# Altium project Pedal_MB.PrjPcb (part 2 of 4)

## Sheet MCU_AUDIO.SchDoc
size A1; SheetNumber: 7; SheetTotal: 13
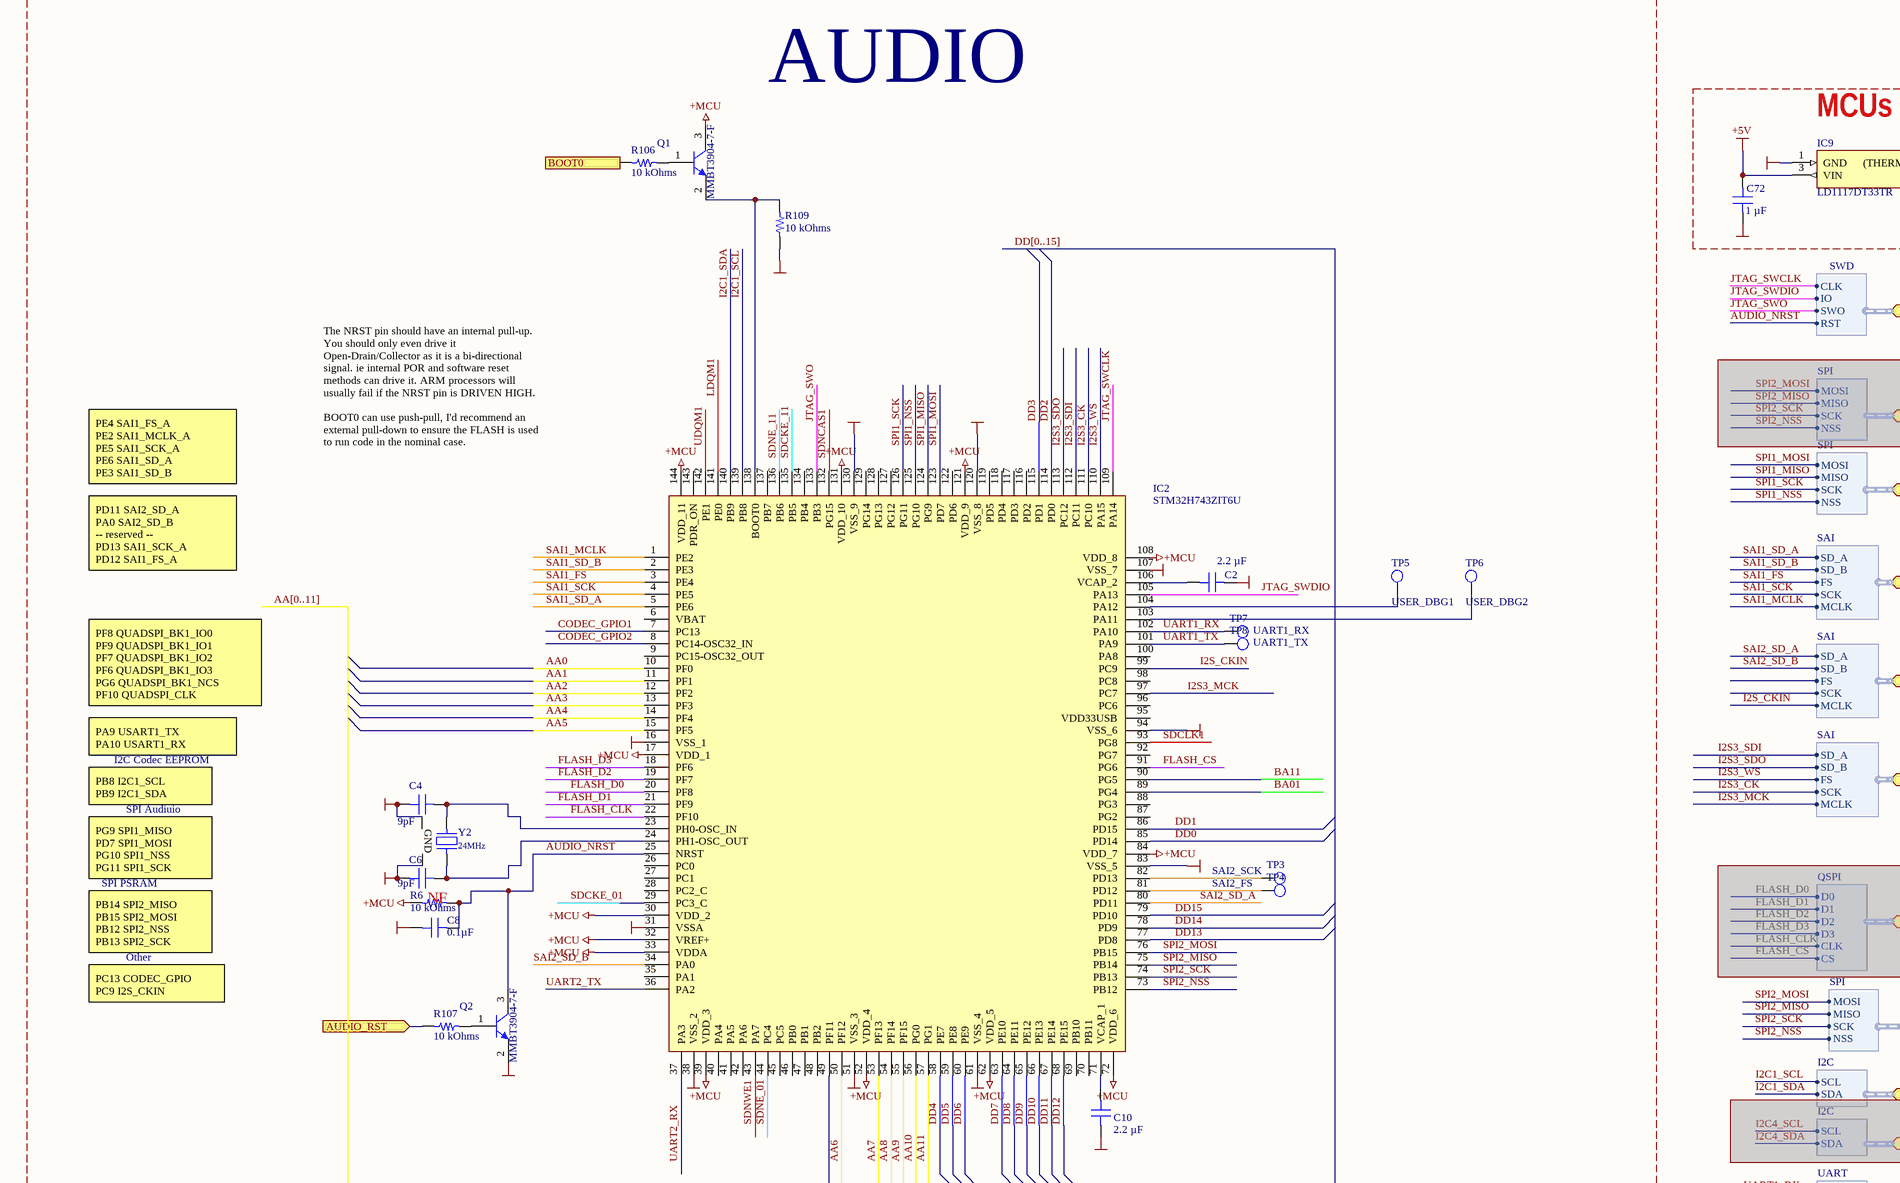
[diagram p9: MCU_AUDIO.SchDoc, top left]
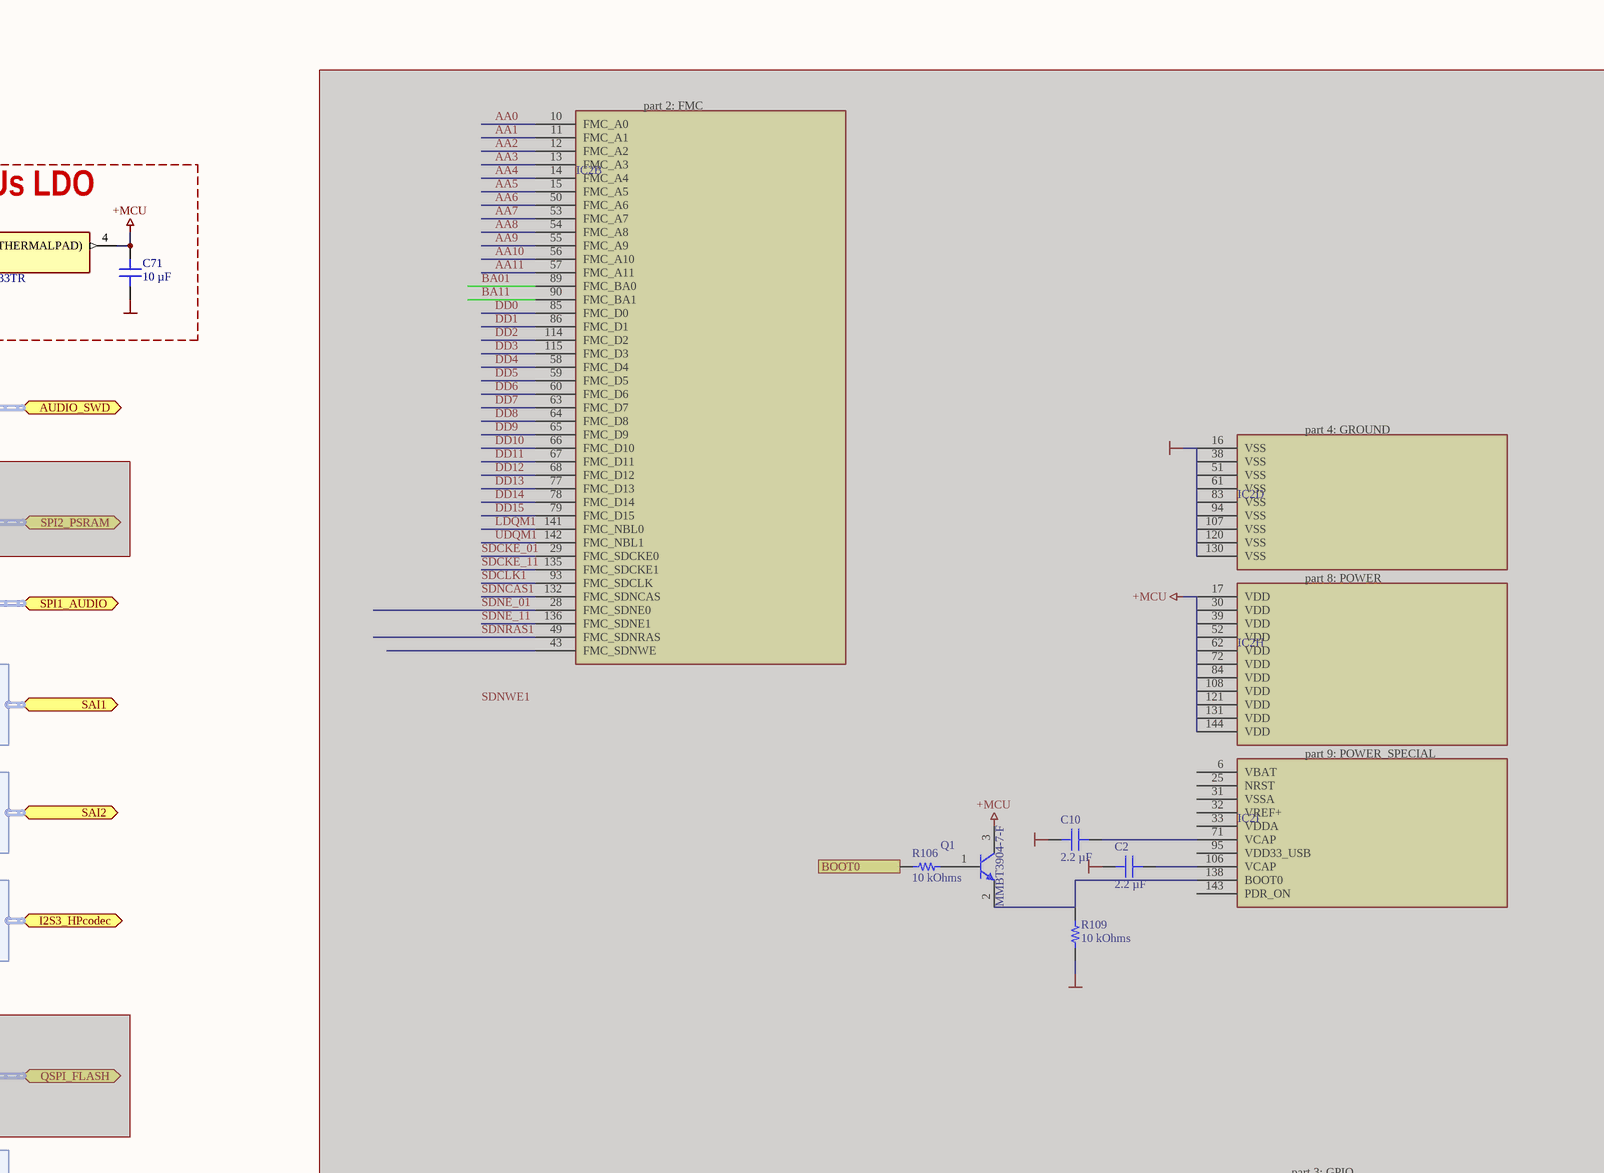
[diagram p10: MCU_AUDIO.SchDoc, top right]
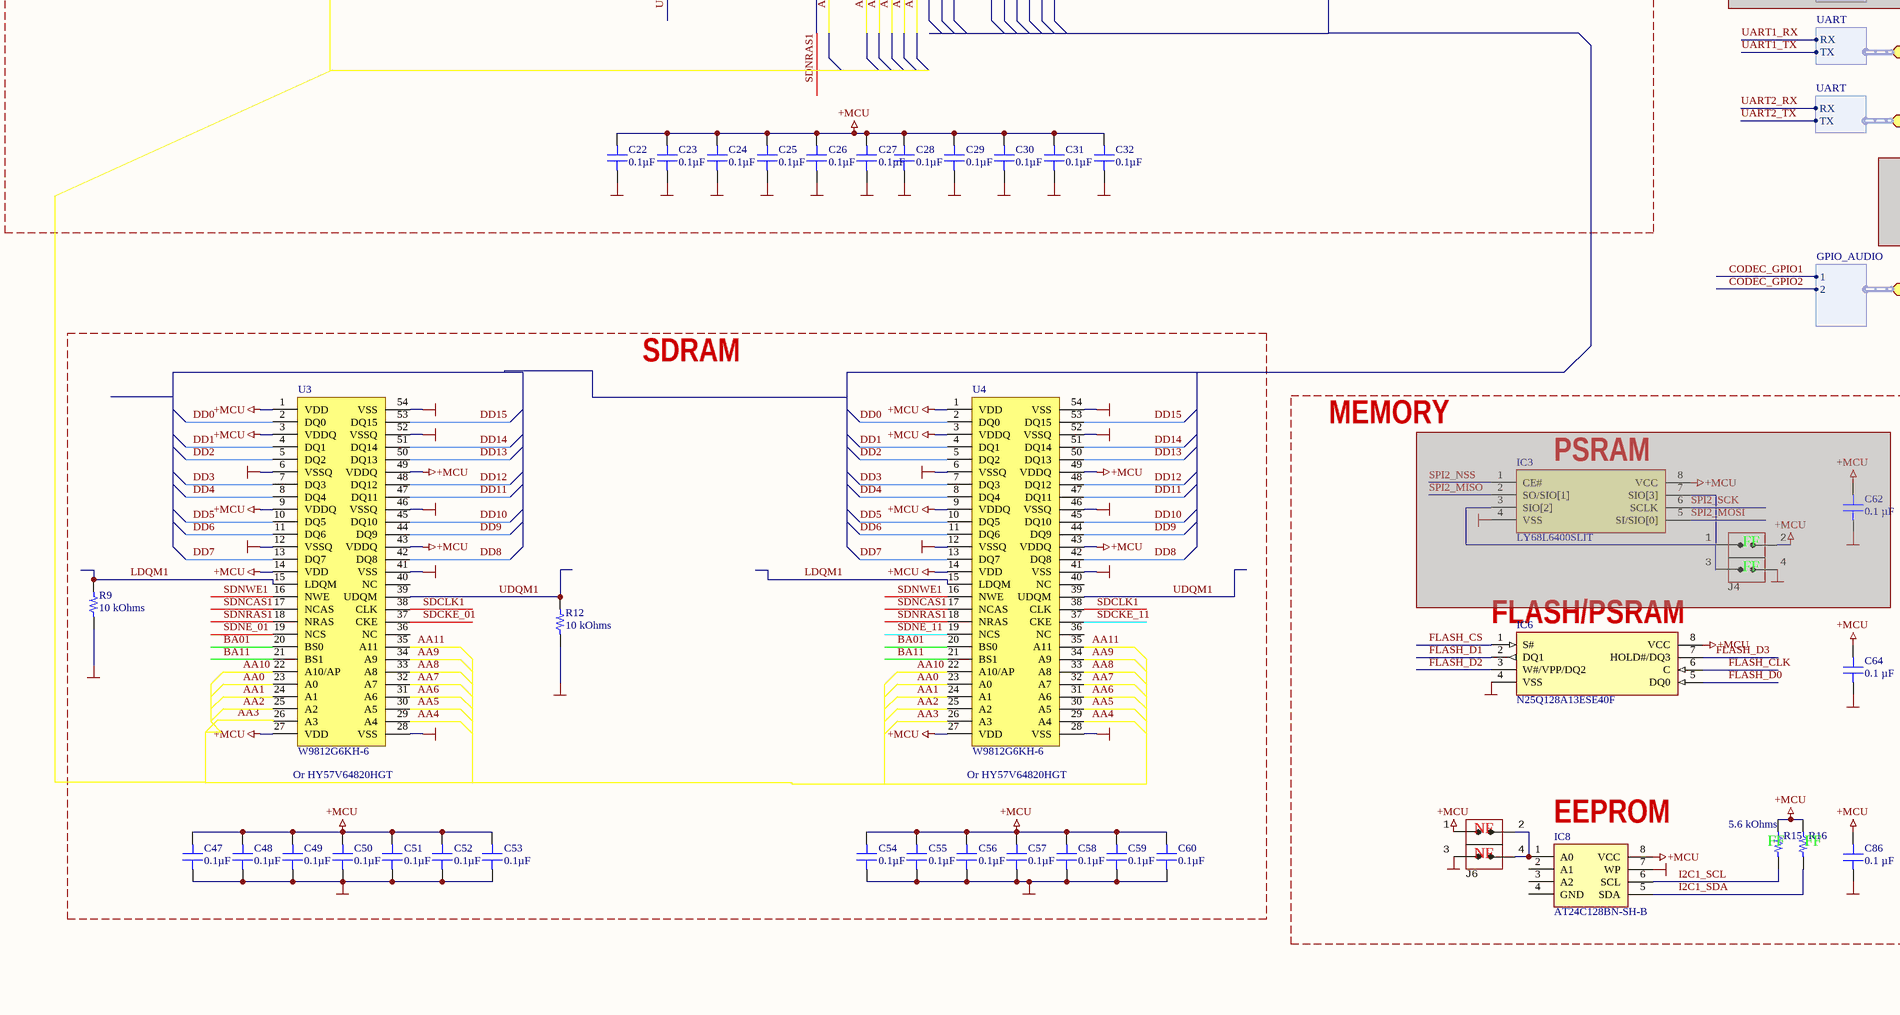
[diagram p11: MCU_AUDIO.SchDoc, bottom left]
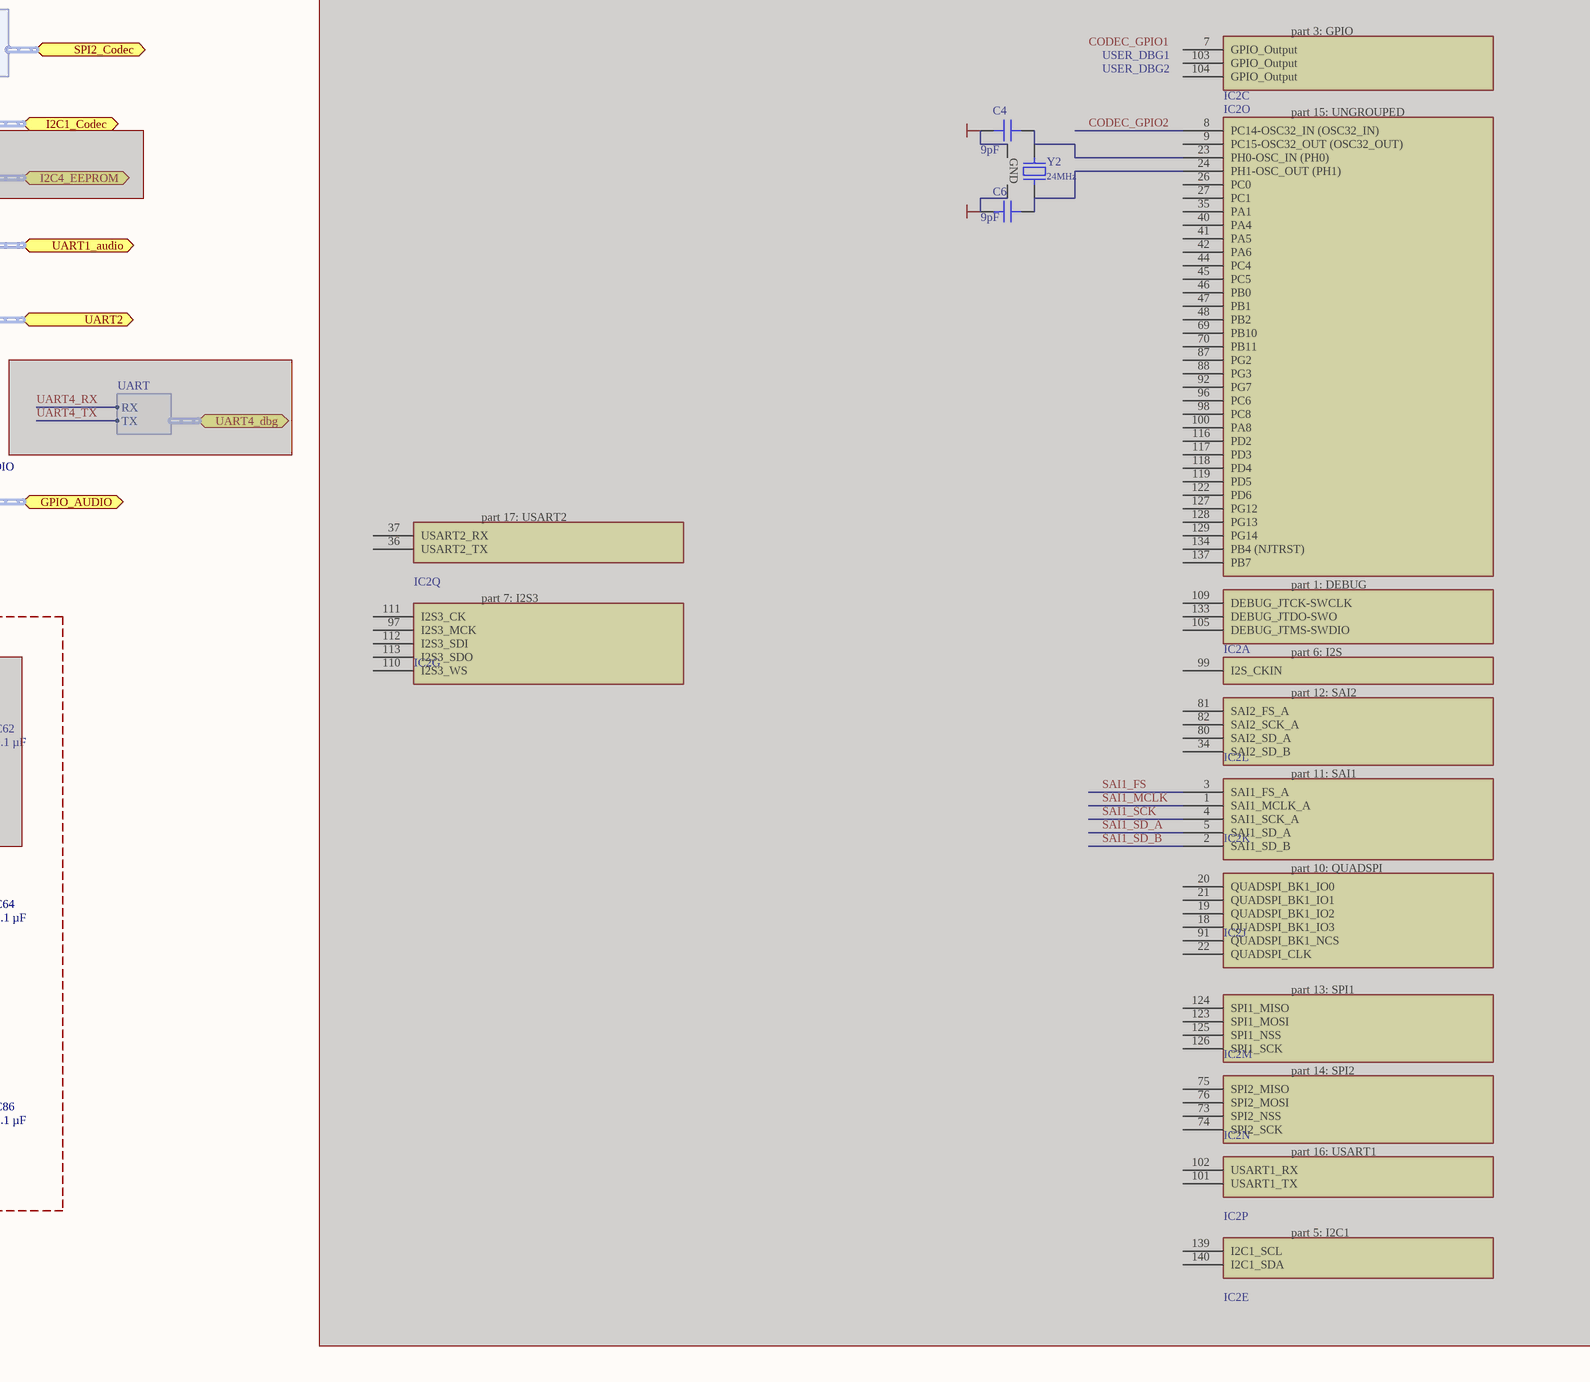
[diagram p12: MCU_AUDIO.SchDoc, bottom right]

### Parts
(Parts that share a designator on the sheet are numbered #1, #2 ... from top to bottom, then left to right.)
C2#1  2.2 µF  [CAP 0805_2012]
C2#2  2.2 µF  [CAP 0805_2012]  (masked out: inside a compile mask, not in the netlist)
C4#1  9pF  [CAP 0805_2012]
C4#2  9pF  [CAP 0805_2012]  (masked out: inside a compile mask, not in the netlist)
C6#1  9pF  [CAP 0805_2012]
C6#2  9pF  [CAP 0805_2012]  (masked out: inside a compile mask, not in the netlist)
C8  0.1µF  [CAP 0402_1005]
C10#1  2.2 µF  [CAP 0805_2012]  (masked out: inside a compile mask, not in the netlist)
C10#2  2.2 µF  [CAP 0805_2012]
C22  0.1µF  [CAP 0402_1005]
C23  0.1µF  [CAP 0402_1005]
C24  0.1µF  [CAP 0402_1005]
C25  0.1µF  [CAP 0402_1005]
C26  0.1µF  [CAP 0402_1005]
C27  0.1µF  [CAP 0402_1005]
C28  0.1µF  [CAP 0402_1005]
C29  0.1µF  [CAP 0402_1005]
C30  0.1µF  [CAP 0402_1005]
C31  0.1µF  [CAP 0402_1005]
C32  0.1µF  [CAP 0402_1005]
C47  0.1µF  [CAP 0402_1005]
C48  0.1µF  [CAP 0402_1005]
C49  0.1µF  [CAP 0402_1005]
C50  0.1µF  [CAP 0402_1005]
C51  0.1µF  [CAP 0402_1005]
C52  0.1µF  [CAP 0402_1005]
C53  0.1µF  [CAP 0402_1005]
C54  0.1µF  [CAP 0402_1005]
C55  0.1µF  [CAP 0402_1005]
C56  0.1µF  [CAP 0402_1005]
C57  0.1µF  [CAP 0402_1005]
C58  0.1µF  [CAP 0402_1005]
C59  0.1µF  [CAP 0402_1005]
C60  0.1µF  [CAP 0402_1005]
C62  0.1 µF  [CAP 0603_1608]  (masked out: inside a compile mask, not in the netlist)
C64  0.1 µF  [CAP 0603_1608]
C71  10 µF  [CAP 0805_2012]
C72  1 µF  [CAP 0805_2012]
C86  0.1 µF  [CAP 0603_1608]
IC2#1  STM32H743ZIT6U  [QFP50P2200X2200X160-144N]
IC2#2  MCU_pinout_audio  [QFP50P2200X2200X160-144N]  (value not drawn)  (parts A,B,C,D,E,F,G,H,I,J,K,L,M,N,O,P,Q of 17)  (masked out: inside a compile mask, not in the netlist)
IC3  LY68L6400SLIT  [SOIC127P600X175-8N]  (masked out: inside a compile mask, not in the netlist)
IC6  N25Q128A13ESE40F  [SOIC127P790X216-8N]
IC8  AT24C128BN-SH-B  [SOIC127P600X175-8N]
IC9  LD1117DT33TR  [TO228P972X240-3N]
J4#2  (no value)  [CON: JUMPER x2]  (masked out: inside a compile mask, not in the netlist)
J6#2  (no value)  [CON: JUMPER x2]
Q1#1  MMBT3904-7-F  [DIODES SOT-23-3]
Q1#2  MMBT3904-7-F  [DIODES SOT-23-3]  (masked out: inside a compile mask, not in the netlist)
Q2  MMBT3904-7-F  [DIODES SOT-23-3]
R6  10 kOhms  [RES 0603_1608]
R9  10 kOhms  [RES 0603_1608]
R12  10 kOhms  [RES 0603_1608]
R15  5.6 kOhms  [RES 0603_1608]
R16  5.6 kOhms  [RES 0603_1608]  (value not drawn)
R106#1  10 kOhms  [RES 0603_1608]
R106#2  10 kOhms  [RES 0603_1608]  (masked out: inside a compile mask, not in the netlist)
R107  10 kOhms  [RES 0603_1608]
R109#1  10 kOhms  [RES 0603_1608]
R109#2  10 kOhms  [RES 0603_1608]  (masked out: inside a compile mask, not in the netlist)
TP3  SAI2_SCK  [TESTPOINT]
TP4  SAI2_FS  [TESTPOINT]
TP5  USER_DBG1  [TESTPOINT]
TP6  USER_DBG2  [TESTPOINT]
TP7  UART1_RX  [TESTPOINT]
TP8  UART1_TX  [TESTPOINT]
U3  W9812G6KH-6  [TSOP-54]
U4  W9812G6KH-6  [TSOP-54]
Y2#1  24MHz  [NDK NX3225SA]
Y2#2  24MHz  [NDK NX3225SA]  (masked out: inside a compile mask, not in the netlist)

### Blocks framed on the sheet
AUDIO: C2#1 C4#1 C6#1 C8 C10#2 C22-C32 IC2#1 Q1#1 Q2 R6 R106#1 R107 R109#1 TP3-TP8 Y2#1
MCUs LDO: C71 C72 IC9
SDRAM: C47-C60 R9 R12 U3 U4

### Ports
AUDIO_RST (in), AUDIO_SWD (bidir, harness SWD), BOOT0 (in), GPIO_AUDIO (bidir, harness GPIO_AUDIO), I2C1_Codec (bidir, harness I2C), I2C4_EEPROM (bidir, harness I2C), I2S3_HPcodec (bidir, harness SAI), QSPI_FLASH (bidir, harness QSPI), SAI1 (bidir, harness SAI), SAI2 (bidir, harness SAI), SPI1_AUDIO (bidir, harness SPI), SPI2_Codec (bidir, harness SPI), SPI2_PSRAM (bidir, harness SPI), UART1_audio (bidir, harness UART), UART2 (bidir, harness UART), UART4_dbg (bidir, harness UART)

### Harnesses
SPI: MOSI, MISO, SCK, NSS
I2C: SCL, SDA
GPIO_AUDIO: 1, 2
UART: RX, TX
QSPI: D0, D1, D2, D3, CLK, CS
SAI: SD_A, SD_B, FS, SCK, MCLK
SWD: CLK, IO, SWO, RST

### Nets
+5V: C72.2 IC9.3(VIN)
+MCU: C22.1 C23.1 C24.1 C25.1 C26.1 C27.1 C28.1 C29.1 C30.1 C31.1 C32.1 C47.1 C48.1 C49.1 C50.1 C51.1 C52.1 C53.1 C54.1 C55.1 C56.1 C57.1 C58.1 C59.1 C60.1 C64.2 C71.2 C86.2 IC2#1.17(VDD_1) IC2#1.30(VDD_2) IC2#1.32(VREF+) IC2#1.33(VDDA) IC2#1.39(VDD_3) IC2#1.52(VDD_4) IC2#1.62(VDD_5) IC2#1.72(VDD_6) IC2#1.84(VDD_7) IC2#1.108(VDD_8) IC2#1.121(VDD_9) IC2#1.131(VDD_10) IC2#1.144(VDD_11) IC6.8(VCC) IC8.8(VCC) IC9.4((THERMALPAD)) J6#2.1(IN) Q1#1.3(C) R6.1 R15.2 R16.2 U3.1(VDD) U3.3(VDDQ) U3.9(VDDQ) U3.14(VDD) U3.27(VDD) U3.43(VDDQ) U3.49(VDDQ) U4.1(VDD) U4.3(VDDQ) U4.9(VDDQ) U4.14(VDD) U4.27(VDD) U4.43(VDDQ) U4.49(VDDQ)
GND: C2#1.2 C4#1.1 C6#1.1 C8.1 C10#2.1 C22.2 C23.2 C24.2 C25.2 C26.2 C27.2 C28.2 C29.2 C30.2 C31.2 C32.2 C47.2 C48.2 C49.2 C50.2 C51.2 C52.2 C53.2 C54.2 C55.2 C56.2 C57.2 C58.2 C59.2 C60.2 C64.1 C71.1 C72.1 C86.1 IC2#1.16(VSS_1) IC2#1.31(VSSA) IC2#1.38(VSS_2) IC2#1.51(VSS_3) IC2#1.61(VSS_4) IC2#1.83(VSS_5) IC2#1.94(VSS_6) IC2#1.107(VSS_7) IC2#1.120(VSS_8) IC2#1.130(VSS_9) IC6.4(VSS) IC8.7(WP) IC9.1(GND) J6#2.3(IN) Q2.2(E) R9.1 R12.1 R109#1.2 U3.6(VSSQ) U3.12(VSSQ) U3.28(VSS) U3.41(VSS) U3.46(VSSQ) U3.52(VSSQ) U3.54(VSS) U4.6(VSSQ) U4.12(VSSQ) U4.28(VSS) U4.41(VSS) U4.46(VSSQ) U4.52(VSSQ) U4.54(VSS) Y2#1.2(GND) Y2#1.4(GND)
AA0: IC2#1.10(PF0) U3.23(A0) U4.23(A0)  [project net AA0_7]
AA1: IC2#1.11(PF1) U3.24(A1) U4.24(A1)  [project net AA1_7]
AA2: IC2#1.12(PF2) U3.25(A2) U4.25(A2)  [project net AA2_7]
AA3: IC2#1.13(PF3) U3.26(A3) U4.26(A3)  [project net AA3_7]
AA4: IC2#1.14(PF4) U3.29(A4) U4.29(A4)  [project net AA4_7]
AA5: IC2#1.15(PF5) U3.30(A5) U4.30(A5)  [project net AA5_7]
AA6: IC2#1.50(PF12) U3.31(A6) U4.31(A6)  [project net AA6_7]
AA7: IC2#1.53(PF13) U3.32(A7) U4.32(A7)  [project net AA7_7]
AA8: IC2#1.54(PF14) U3.33(A8) U4.33(A8)  [project net AA8_7]
AA9: IC2#1.55(PF15) U3.34(A9) U4.34(A9)  [project net AA9_7]
AA10: IC2#1.56(PG0) U3.22(A10/AP) U4.22(A10/AP)  [project net AA10_7]
AA11: IC2#1.57(PG1) U3.35(A11) U4.35(A11)  [project net AA11_7]
AUDIO_BOOT: R106#1.1 ; port BOOT0
AUDIO_NRST: C8.2 IC2#1.25(NRST) Q2.3(C) R6.2 ; port AUDIO_SWD.RST
AUDIO_RST: R107.1 ; port AUDIO_RST
BA01: IC2#1.89(PG4) U3.20(BS0) U4.20(BS0)  [project net BA01_7]
BA11: IC2#1.90(PG5) U3.21(BS1) U4.21(BS1)  [project net BA11_7]
CODEC_GPIO1: IC2#1.7(PC13) ; port GPIO_AUDIO.1
CODEC_GPIO2: IC2#1.8(PC14-OSC32_IN) ; port GPIO_AUDIO.2
DD0: IC2#1.85(PD14) U3.2(DQ0) U4.2(DQ0)  [project net DD0_7]
DD1: IC2#1.86(PD15) U3.4(DQ1) U4.4(DQ1)  [project net DD1_7]
DD2: IC2#1.114(PD0) U3.5(DQ2) U4.5(DQ2)  [project net DD2_7]
DD3: IC2#1.115(PD1) U3.7(DQ3) U4.7(DQ3)  [project net DD3_7]
DD4: IC2#1.58(PE7) U3.8(DQ4) U4.8(DQ4)  [project net DD4_7]
DD5: IC2#1.59(PE8) U3.10(DQ5) U4.10(DQ5)  [project net DD5_7]
DD6: IC2#1.60(PE9) U3.11(DQ6) U4.11(DQ6)  [project net DD6_7]
DD7: IC2#1.63(PE10) U3.13(DQ7) U4.13(DQ7)  [project net DD7_7]
DD8: IC2#1.64(PE11) U3.42(DQ8) U4.42(DQ8)  [project net DD8_7]
DD9: IC2#1.65(PE12) U3.44(DQ9) U4.44(DQ9)  [project net DD9_7]
DD10: IC2#1.66(PE13) U3.45(DQ10) U4.45(DQ10)  [project net DD10_7]
DD11: IC2#1.67(PE14) U3.47(DQ11) U4.47(DQ11)  [project net DD11_7]
DD12: IC2#1.68(PE15) U3.48(DQ12) U4.48(DQ12)  [project net DD12_7]
DD13: IC2#1.77(PD8) U3.50(DQ13) U4.50(DQ13)  [project net DD13_7]
DD14: IC2#1.78(PD9) U3.51(DQ14) U4.51(DQ14)  [project net DD14_7]
DD15: IC2#1.79(PD10) U3.53(DQ15) U4.53(DQ15)  [project net DD15_7]
FLASH_CLK: IC2#1.22(PF10) IC6.6(C)  [project net FLASH_CLK_7]
FLASH_CS: IC2#1.91(PG6) IC6.1(S#)  [project net FLASH_CS_7]
FLASH_D0: IC2#1.20(PF8) IC6.5(DQ0)  [project net FLASH_D0_7]
FLASH_D1: IC2#1.21(PF9) IC6.2(DQ1)  [project net FLASH_D1_7]
FLASH_D2: IC2#1.19(PF7) IC6.3(W#/VPP/DQ2)  [project net FLASH_D2_7]
FLASH_D3: IC2#1.18(PF6) IC6.7(HOLD#/DQ3)  [project net FLASH_D3_7]
I2C1_SCL: IC2#1.139(PB8) IC8.6(SCL) R15.1 ; port I2C1_Codec.SCL
I2C1_SDA: IC2#1.140(PB9) IC8.5(SDA) R16.1 ; port I2C1_Codec.SDA
I2S3_CK: IC2#1.111(PC10) ; port I2S3_HPcodec.SCK
I2S3_MCK: IC2#1.97(PC7) ; port I2S3_HPcodec.MCLK
I2S3_SDI: IC2#1.112(PC11) ; port I2S3_HPcodec.SD_A
I2S3_SDO: IC2#1.113(PC12) ; port I2S3_HPcodec.SD_B
I2S3_WS: IC2#1.110(PA15) ; port I2S3_HPcodec.FS
I2S_CKIN: IC2#1.99(PC9) ; port SAI2.MCLK
JTAG_SWCLK: IC2#1.109(PA14) ; port AUDIO_SWD.CLK  [project net AUDIO_SWD.CLK]
JTAG_SWDIO: IC2#1.105(PA13) ; port AUDIO_SWD.IO  [project net AUDIO_SWD.IO]
JTAG_SWO: IC2#1.133(PB3) ; port AUDIO_SWD.SWO  [project net AUDIO_SWD.SWO]
LDQM1: IC2#1.141(PE0) R9.2 U3.15(LDQM) U4.15(LDQM)  [project net LDQM1_7]
SAI1_FS: IC2#1.3(PE4) ; port SAI1.FS
SAI1_MCLK: IC2#1.1(PE2) ; port SAI1.MCLK
SAI1_SCK: IC2#1.4(PE5) ; port SAI1.SCK
SAI1_SD_A: IC2#1.5(PE6) ; port SAI1.SD_A
SAI1_SD_B: IC2#1.2(PE3) ; port SAI1.SD_B
SAI2_SD_A: IC2#1.80(PD11) ; port SAI2.SD_A
SAI2_SD_B: IC2#1.34(PA0) ; port SAI2.SD_B
SDCKE_01: IC2#1.29(PC3_C) U3.37(CKE)  [project net SDCKE_01_7]
SDCKE_11: IC2#1.135(PB5) U4.37(CKE)  [project net SDCKE_11_7]
SDCLK1: IC2#1.93(PG8) U3.38(CLK) U4.38(CLK)  [project net SDCLK1_7]
SDNCAS1: IC2#1.132(PG15) U3.17(NCAS) U4.17(NCAS)  [project net SDNCAS1_7]
SDNE_01: IC2#1.44(PC4) U3.19(NCS)  [project net SDNE_01_7]
SDNE_11: IC2#1.136(PB6) U4.19(NCS)  [project net SDNE_11_7]
SDNRAS1: IC2#1.49(PF11) U3.18(NRAS) U4.18(NRAS)  [project net SDNRAS1_7]
SDNWE1: IC2#1.43(PA7) U3.16(NWE) U4.16(NWE)  [project net SDNWE1_7]
SPI1_MISO: IC2#1.124(PG9) ; port SPI1_AUDIO.MISO
SPI1_MOSI: IC2#1.123(PD7) ; port SPI1_AUDIO.MOSI
SPI1_NSS: IC2#1.125(PG10) ; port SPI1_AUDIO.NSS
SPI1_SCK: IC2#1.126(PG11) ; port SPI1_AUDIO.SCK
SPI2_MISO: IC2#1.75(PB14) ; port SPI2_Codec.MISO
SPI2_MOSI: IC2#1.76(PB15) ; port SPI2_Codec.MOSI
SPI2_NSS: IC2#1.73(PB12) ; port SPI2_Codec.NSS
SPI2_SCK: IC2#1.74(PB13) ; port SPI2_Codec.SCK
UART1_RX: IC2#1.102(PA10) TP7.1 ; port UART1_audio.RX
UART1_TX: IC2#1.101(PA9) TP8.1 ; port UART1_audio.TX
UART2_RX: IC2#1.37(PA3) ; port UART2.RX
UART2_TX: IC2#1.36(PA2) ; port UART2.TX
UDQM1: IC2#1.142(PE1) R12.2 U3.39(UDQM) U4.39(UDQM)  [project net UDQM1_7]
NetC2#1_1: C2#1.1 IC2#1.106(VCAP_2)
NetC4#1_2: C4#1.2 IC2#1.23(PH0-OSC_IN) Y2#1.1
NetC6#1_2: C6#1.2 IC2#1.24(PH1-OSC_OUT) Y2#1.3
NetC10#2_2: C10#2.2 IC2#1.71(VCAP_1)
NetIC2#1_81: IC2#1.81(PD12) TP4.1
NetIC2#1_82: IC2#1.82(PD13) TP3.1
NetIC2#1_103: IC2#1.103(PA11) TP6.1
NetIC2#1_104: IC2#1.104(PA12) TP5.1
NetIC2#1_138: IC2#1.138(BOOT0) Q1#1.2(E) R109#1.1
NetIC8_1: IC8.1(A0) J6#2.2(IN) J6#2.4(IN)
NetQ1#1_1: Q1#1.1(B) R106#1.2
NetQ2_1: Q2.1(B) R107.2

Not connected (* = marked no-connect by the designer): IC2#1 6(VBAT) 9(PC15-OSC32_OUT) 26(PC0) 27(PC1) 28(PC2_C) 35(PA1) 40(PA4) 41(PA5) 42(PA6) 45(PC5) 46(PB0) 47(PB1) 48(PB2) 69(PB10) 70(PB11) 87(PG2) 88(PG3) 92(PG7) 95(VDD33USB) 96(PC6) 98(PC8) 100(PA8) 116(PD2) 117(PD3) 118(PD4) 119(PD5) 122(PD6) 127(PG12) 128(PG13) 129(PG14) 134(PB4) 137(PB7) 143(PDR_ON); IC8 2(A1) 3(A2) 4(GND); U3 36(NC) 40(NC); U4 36(NC) 40(NC)

### Buses and harness runs
bus AA[0..11]
bus DD[0..15]

### Notes on the sheet
- PE4	SAI1_FS_A
  PE2	SAI1_MCLK_A
  PE5	SAI1_SCK_A
  PE6	SAI1_SD_A
  PE3	SAI1_SD_B
- The NRST pin should have an internal pull-up. You should only even drive it Open-Drain/Collector as it is a bi-directional signal. ie internal POR and software reset methods can drive it. ARM processors will usually fail if the NRST pin is DRIVEN HIGH.
  BOOT0 can use push-pull, I'd recommend an external pull-down to ensure the FLASH is used to run code in the nominal case.
- PD11	SAI2_SD_A
  PA0	SAI2_SD_B
  -- reserved --
  PD13	SAI1_SCK_A
  PD12	SAI1_FS_A
- PF8	QUADSPI_BK1_IO0
  PF9	QUADSPI_BK1_IO1
  PF7	QUADSPI_BK1_IO2
  PF6	QUADSPI_BK1_IO3
  PG6	QUADSPI_BK1_NCS
  PF10	QUADSPI_CLK
- PA9	USART1_TX
  PA10	USART1_RX
- I2C Codec EEPROM
- PB8	I2C1_SCL
  PB9	I2C1_SDA
- SPI Audiuio
- PG9	SPI1_MISO
  PD7	SPI1_MOSI
  PG10	SPI1_NSS
  PG11	SPI1_SCK
- SPI PSRAM
- (near R6) NF
- PB14	SPI2_MISO
  PB15	SPI2_MOSI
  PB12	SPI2_NSS
  PB13	SPI2_SCK
- Other
- PC13	CODEC_GPIO
  PC9	I2S_CKIN
- USER_DBG1
- USER_DBG2
- MEMORY
- (near IC3) PSRAM
- (near J4#2) FF
- (near IC6) FLASH/PSRAM
- (near U3) Or HY57V64820HGT
- (near U4) Or HY57V64820HGT
- (near J6#2) NF
- (near IC8) EEPROM
- (near R15) FF
- (near R16) FF
- (in symbol MCU_pinout_audio, part A) part 1: DEBUG
- (in symbol MCU_pinout_audio, part B) part 2: FMC
- (in symbol MCU_pinout_audio, part C) part 3: GPIO
- (in symbol MCU_pinout_audio, part D) part 4: GROUND
- (in symbol MCU_pinout_audio, part E) part 5: I2C1
- (in symbol MCU_pinout_audio, part F) part 6: I2S
- (in symbol MCU_pinout_audio, part G) part 7: I2S3
- (in symbol MCU_pinout_audio, part H) part 8: POWER
- (in symbol MCU_pinout_audio, part I) part 9: POWER_SPECIAL
- (in symbol MCU_pinout_audio, part J) part 10: QUADSPI
- (in symbol MCU_pinout_audio, part K) part 11: SAI1
- (in symbol MCU_pinout_audio, part L) part 12: SAI2
- (in symbol MCU_pinout_audio, part M) part 13: SPI1
- (in symbol MCU_pinout_audio, part N) part 14: SPI2
- (in symbol MCU_pinout_audio, part O) part 15: UNGROUPED
- (in symbol MCU_pinout_audio, part P) part 16: USART1
- (in symbol MCU_pinout_audio, part Q) part 17: USART2

### Library data of the parts
C2#1 C2#2 C10#1 C10#2 = C0805C225K8RAC7800: CAP CER 2.2UF 10V X7R 0805; manufacturer: KEMET; Tolerance: ±10%; Part Number: C0805C225K8RAC7800; Value: 2.2 µF; Applications: Bypass, Decoupling; Capacitance: 2.2 µF; componentlink1description: Datasheet; componentlink1url: https://api.kemet.com/component-edge/download/datasheet/C0805C225K8RACTU.pdf; componentlink2description: DigiKey Link; componentlink2url: https://www.digikey.com/en/products/detail/kemet/C0805C225K8RAC7800/789654; Device Package: 0805 (2012 Metric); lastupdated: 3/27/2023 7:09:32 PM; Lifecycle Status: Active; Minimum Order: 1; Mounting Type: Surface Mount, MLCC; Operating Temperature: -55°C ~ 125°C; Package / Case: 0805 (2012 Metric); packaging: TapeAndReel; partid: 32363; Part Status: Active; price: 0.03; series: SMD Comm X7R; Size / Dimension: 0.079" L x 0.049" W (2.00mm x 1.25mm); Supplier 1: DigiKey; Supplier Part Number 1: 399-C0805C225K8RAC7800CT-ND; Temperature Coefficient: X7R; Thickness (Max): 0.055" (1.40mm); Voltage - Rated: 10V
C4#1 C4#2 C6#1 C6#2 = CBR08C909CAGAC: CAP CER 9PF 250V C0G/NP0 0805; Manufacturer: KEMET; Temperature Coefficient: C0G, NP0; Tolerance: ±0.25pF; Part Number: CBR08C909CAGAC; Value: 9pF; Applications: RF, Microwave, High Frequency; Capacitance: 9pF; ComponentLink1Description: Datasheet; ComponentLink1URL: https://api.kemet.com/component-edge/download/datasheet/CBR08C909CAGAC.pdf; ComponentLink2Description: DigiKey Link; ComponentLink2URL: http://digikey.com/product-detail/en/kemet/CBR08C909CAGAC/399-8711-1-ND/3480335; Device Package: 0805 (2012 Metric); Features: High Q, Low Loss, Ultra Low ESR; LastUpdated: 9/2/2020 1:04:31 AM; Lifecycle Status: Active; Minimum Order: 1; Mounting Type: Surface Mount, MLCC; Operating Temperature: -55°C ~ 125°C; Package / Case: 0805 (2012 Metric); Packaging: TapeAndReel; PartId: 8592; Part Status: Active; Price: 0.28; Series: CBR-SMD RF C0G; Size / Dimension: 0.079" L x 0.049" W (2.00mm x 1.25mm); Supplier 1: DigiKey; Supplier Part Number 1: 399-8711-1-ND; Thickness (Max): 0.035" (0.88mm); Voltage - Rated: 250V
C8 C22-C32 C47-C60 = C0402C104K4RACAUTO: CAP CER 0.1UF 16V X7R 0402; Manufacturer: KEMET; Tolerance: ±10%; Part Number: C0402C104K4RACAUTO; Value: 0.1µF; Applications: Automotive, Bypass, Decoupling; Capacitance: 0.1µF; ComponentLink1Description: Datasheet; ComponentLink1URL: https://api.kemet.com/component-edge/download/specsheet/C0402C104K4RACAUTO.pdf; ComponentLink2Description: DigiKey Link; ComponentLink2URL: http://digikey.com/product-detail/en/kemet/C0402C104K4RACAUTO/399-6828-1-ND/3314343; Device Package: 0402 (1005 Metric); LastUpdated: 9/2/2020 1:02:21 AM; Lifecycle Status: Active; Minimum Order: 1; Mounting Type: Surface Mount, MLCC; Operating Temperature: -55°C ~ 125°C; Package / Case: 0402 (1005 Metric); Packaging: TapeAndReel; PartId: 3024; Part Status: Active; Price: 0.01; Ratings: AEC-Q200; Series: SMD Auto X7R; Size / Dimension: 0.039" L x 0.020" W (1.00mm x 0.50mm); Supplier 1: DigiKey; Supplier Part Number 1: 399-6828-1-ND; Temperature Coefficient: X7R; Thickness (Max): 0.022" (0.55mm); Voltage - Rated: 16V
C62 C64 C86 = C0603C104K5RAC7411: CAP CER 0.1UF 50V X7R 0603; manufacturer: KEMET; Tolerance: ±10%; Part Number: C0603C104K5RAC7411; Value: 0.1 µF; Applications: Bypass, Decoupling; Capacitance: 0.1 µF; componentlink1description: Datasheet; componentlink1url: https://api.kemet.com/component-edge/download/datasheet/C0603C104K5RAC7411.pdf; componentlink2description: DigiKey Link; componentlink2url: https://www.digikey.com/en/products/detail/kemet/C0603C104K5RAC7411/3317013; Device Package: 0603 (1608 Metric); lastupdated: 2/9/2024 8:10:30 PM; Lifecycle Status: Active; Minimum Order: 1; Mounting Type: Surface Mount, MLCC; Operating Temperature: -55°C ~ 125°C; Package / Case: 0603 (1608 Metric); packaging: TapeAndReel; partid: 2233; Part Status: Active; price: 0.01; series: SMD Comm X7R; Size / Dimension: 0.063" L x 0.031" W (1.60mm x 0.80mm); Supplier 1: DigiKey; Supplier Part Number 1: 399-C0603C104K5RAC7411CT-ND; Temperature Coefficient: X7R; Thickness (Max): 0.035" (0.90mm); Voltage - Rated: 50V
C71 = C0805C106K8PAC7800: CAP CER 10UF 10V X5R 0805; manufacturer: KEMET; Tolerance: ±10%; Part Number: C0805C106K8PAC7800; Value: 10 µF; Applications: Bypass, Decoupling; Capacitance: 10 µF; componentlink1description: Datasheet; componentlink1url: https://connect.kemet.com:7667/gateway/IntelliData-ComponentDocumentation/1.0/download/datasheet/C0805C106K8PACTU; componentlink2description: DigiKey Link; componentlink2url: https://www.digikey.com/en/products/detail/kemet/C0805C106K8PAC7800/1090830; Device Package: 0805 (2012 Metric); lastupdated: 9/14/2022 7:51:56 AM; Lifecycle Status: Active; Minimum Order: 1; Mounting Type: Surface Mount, MLCC; Operating Temperature: -55°C ~ 85°C; Package / Case: 0805 (2012 Metric); packaging: TapeAndReel; partid: 44790; Part Status: Active; price: 0.02; series: SMD Comm X5R; Size / Dimension: 0.079" L x 0.049" W (2.00mm x 1.25mm); Supplier 1: DigiKey; Supplier Part Number 1: 399-C0805C106K8PAC7800CT-ND; Temperature Coefficient: X5R; Thickness (Max): 0.055" (1.40mm); Voltage - Rated: 10V
C72 = C0805C105K4RAC7800: CAP CER 1UF 16V X7R 0805; manufacturer: KEMET; Tolerance: ±10%; Part Number: C0805C105K4RAC7800; Value: 1 µF; Applications: Bypass, Decoupling; Capacitance: 1 µF; componentlink1description: Datasheet; componentlink1url: https://api.kemet.com/component-edge/download/datasheet/C0805C105K4RACTU.pdf; componentlink2description: DigiKey Link; componentlink2url: https://www.digikey.com/en/products/detail/kemet/C0805C105K4RAC7800/416047; Device Package: 0805 (2012 Metric); lastupdated: 9/19/2022 1:03:30 PM; Lifecycle Status: Active; Minimum Order: 1; Mounting Type: Surface Mount, MLCC; Operating Temperature: -55°C ~ 125°C; Package / Case: 0805 (2012 Metric); packaging: TapeAndReel; partid: 32075; Part Status: Active; price: 0.01; series: SMD Comm X7R; Size / Dimension: 0.079" L x 0.049" W (2.00mm x 1.25mm); Supplier 1: DigiKey; Supplier Part Number 1: 399-C0805C105K4RAC7800CT-ND; Temperature Coefficient: X7R; Thickness (Max): 0.039" (1.00mm); Voltage - Rated: 16V
IC2#1 = STM32H743ZIT6U: Integrated Circuit; Manufacturer_Name: STMicroelectronics; Datasheet Link: https://componentsearchengine.com/Datasheets/1/STM32H743ZIT6U.pdf; Height: 1.6mm; Manufacturer_Part_Number: STM32H743ZIT6U; Mouser Part Number: N/A; Mouser Price/Stock: https://www.mouser.co.uk/ProductDetail/STMicroelectronics/STM32H743ZIT6U?qs=PzGy0jfpSMtTUBlZwwPqMQ%3D%3D
IC2#2 = MCU_pinout_audio: MCU with 144 pins / Grouped by function
IC3 = LY68L6400SLIT: Integrated Circuit; Manufacturer_Name: Lyontek Inc.; Datasheet Link: https://datasheet.lcsc.com/szlcsc/Lyontek-Inc-LY68L6400SLIT_C261881.pdf; Height: 1.75mm; Manufacturer_Part_Number: LY68L6400SLIT
IC6 = N25Q128A13ESE40F: Integrated Circuit; Manufacturer_Name: Micron; Datasheet Link: https://datasheet.datasheetarchive.com/originals/distributors/Datasheets-DGA23/1494983.pdf; Height: 2.16mm; Manufacturer_Part_Number: N25Q128A13ESE40F; Mouser Part Number: 340-182267; Mouser Price/Stock: https://www.mouser.co.uk/ProductDetail/Micron/N25Q128A13ESE40F?qs=taEdVNyAfdHw8xv9Y4zfpQ%3D%3D; Arrow Part Number: N25Q128A13ESE40F; Arrow Price/Stock: https://www.arrow.com/en/products/n25q128a13ese40f/micron-technology
IC8 = AT24C128BN-SH-B: Integrated Circuit; Manufacturer_Name: Microchip; Datasheet Link: https://componentsearchengine.com/Datasheets/1/AT24C128BN-SH-B.pdf; Height: 1.75mm; Manufacturer_Part_Number: AT24C128BN-SH-B; Mouser Part Number: 556-A24C128BNSH-B; Mouser Price/Stock: https://www.mouser.co.uk/ProductDetail/Microchip-Technology-Atmel/AT24C128BN-SH-B?qs=j6lVIf5KywAfpl9r4qbAuQ%3D%3D
IC9 = LD1117DT33TR: Integrated Circuit; Manufacturer_Name: STMicroelectronics; Datasheet Link: http://www.st.com/web/en/resource/technical/document/datasheet/CD00000544.pdf; Height: 2.4mm; Manufacturer_Part_Number: LD1117DT33TR; Mouser Part Number: 511-LD1117DT33-TR; Mouser Price/Stock: https://www.mouser.co.uk/ProductDetail/STMicroelectronics/LD1117DT33TR?qs=4JhUBQGAOSd4P5jVYGxp2g%3D%3D; Arrow Part Number: LD1117DT33TR; Arrow Price/Stock: https://www.arrow.com/en/products/ld1117dt33tr/stmicroelectronics?region=nac
J4#2 J6#2 = Jumper_double: CommentText: "Перемычка"
Q1#1 Q1#2 Q2 = MMBT3904-7-F: TRANS NPN 40V 0.2A SOT23-3; Manufacturer: Diodes Incorporated; Current - Collector Cutoff (Max): 50nA (ICBO); Current - Collector (Ic) (Max): 200 mA; DC Current Gain (hFE) (Min) @ Ic, Vce: 100 @ 10mA, 1V; Frequency - Transition: 300MHz; Power - Max: 300 mW; Vce Saturation (Max) @ Ib, Ic: 300mV @ 5mA, 50mA; Part Number: MMBT3904-7-F; ComponentLink1Description: Datasheet; ComponentLink1URL: https://www.diodes.com/assets/Datasheets/ds30036.pdf; ComponentLink2Description: DigiKey Link; ComponentLink2URL: https://www.digikey.com/en/products/detail/diodes-incorporated/MMBT3904-7-F/814494; LastUpdated: 2/8/2024 9:54:04 PM; Lifecycle Status: Active; Minimum Order: 1; Mounting Type: Surface Mount; Operating Temperature: -55°C ~ 150°C (TJ); Package / Case: TO-236-3, SC-59, SOT-23-3; Packaging: TapeAndReel; PartId: 85; Part Status: Active; Price: 0.01; Series: -; Supplier 1: DigiKey; Supplier Part Number 1: MMBT3904-FDICT-ND; Supplier Device Package: SOT-23-3; Transistor Type: NPN; Voltage - Collector Emitter Breakdown (Max): 40 V
R6 R9 R12 R106#1 R106#2 R107 R109#1 R109#2 = ERJ-3EKF1002V: RES SMD 10K OHM 1% 1/10W 0603; Manufacturer: Panasonic Electronic Components; Power (Watts): 0.1W, 1/10W; Temperature Coefficient: ±100ppm/°C; Part Number: ERJ-3EKF1002V; Value: 10 kOhms; ComponentLink1Description: Datasheet; ComponentLink1URL: https://industrial.panasonic.com/cdbs/www-data/pdf/RDA0000/AOA0000C304.pdf; ComponentLink2Description: DigiKey Link; ComponentLink2URL: https://www.digikey.com/en/products/detail/panasonic-electronic-components/ERJ-3EKF1002V/196066; Composition: Thick Film; Device Package: 0603 (1608 Metric); Height - Seated (Max): 0.022" (0.55mm); LastUpdated: 2/9/2024 8:41:59 PM; Lifecycle Status: Active; Minimum Order: 1; Number of Terminations: 2; Operating Temperature: -55°C ~ 155°C; Package / Case: 0603 (1608 Metric); Packaging: TapeAndReel; PartId: 25695; Part Status: Active; Price: 0.01; Resistance: 10 kOhms; Series: ERJ-3EK; Size / Dimension: 0.063" L x 0.031" W (1.60mm x 0.80mm); Supplier 1: DigiKey; Supplier Part Number 1: P10.0KHCT-ND; Supplier Device Package: 0603; Tolerance: ±1%; Features: Automotive AEC-Q200; Ratings: AEC-Q200
R15 R16 = RT0603DRE075K6L: RES SMD 5.6K OHM 0.5% 1/10W 0603; Manufacturer: Yageo; Power (Watts): 0.1W, 1/10W; Temperature Coefficient: ±50ppm/°C; Part Number: RT0603DRE075K6L; Value: 5.6 kOhms; ComponentLink1Description: Datasheet; ComponentLink1URL: https://www.yageo.com/upload/media/product/productsearch/datasheet/rchip/PYu-RT_1-to-0.01_RoHS_L_11.pdf; ComponentLink2Description: DigiKey Link; ComponentLink2URL: http://digikey.com/product-detail/en/yageo/RT0603DRE075K6L/311-2635-1-ND/6129054; Composition: Thin Film; Device Package: 0603 (1608 Metric); Height - Seated (Max): 0.022" (0.55mm); LastUpdated: 9/2/2020 1:10:05 AM; Lifecycle Status: Active; Minimum Order: 1; Number of Terminations: 2; Operating Temperature: -55°C ~ 155°C; Package / Case: 0603 (1608 Metric); Packaging: TapeAndReel; PartId: 14197; Part Status: Active; Price: 0.01; Resistance: 5.6 kOhms; Series: RT; Size / Dimension: 0.063" L x 0.031" W (1.60mm x 0.80mm); Supplier 1: DigiKey; Supplier Part Number 1: 311-2635-1-ND; Supplier Device Package: 0603; Tolerance: ±0.5%
TP3-TP8 = TestPoint
Y2#1 Y2#2 = NX3225SA-24MHZ-EXS00A-CS07532: CRYSTAL 24MHZ 9PF SMD; Manufacturer: NDK America, Inc.; ESR (Equivalent Series Resistance): 100 Ohms; Operating Mode: Fundamental; Part Number: NX3225SA-24MHZ-EXS00A-CS07532; ComponentLink2Description: DigiKey Link; ComponentLink2URL: http://digikey.com/product-detail/en/ndk-america-inc/NX3225SA-24MHZ-EXS00A-CS07532/644-1393-1-ND/9172121; Frequency: 24MHz; Height - Seated (Max): 0.024" (0.60mm); LastUpdated: 9/2/2020 1:21:59 AM; Lifecycle Status: Active; Load Capacitance: 9pF; Minimum Order: 1; Mounting Type: Surface Mount; Operating Temperature: -40°C ~ 150°C; Package / Case: 4-SMD, No Lead; Packaging: TapeAndReel; PartId: 571; Part Status: Active; Price: 0.38; Ratings: AEC-Q200; Series: NX3225SA; Size / Dimension: 0.126" L x 0.098" W (3.20mm x 2.50mm); Supplier 1: DigiKey; Supplier Part Number 1: 644-1393-1-ND; Type: MHz Crystal; Value: 24MHz

## Sheet MISO_LSH.SchDoc
size A4; SheetNumber: 8; SheetTotal: 10
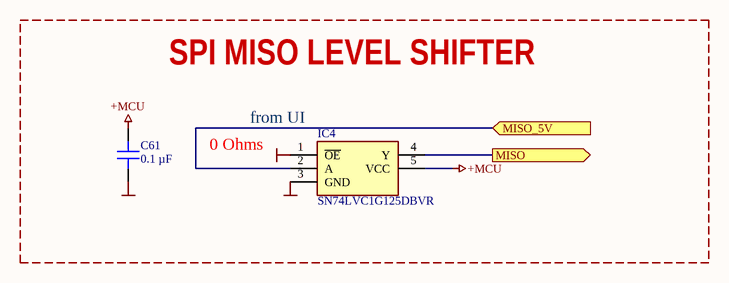
[diagram p13: MISO_LSH.SchDoc]

### Parts
C61  0.1 µF  [CAP 0603_1608]
IC4  SN74LVC1G125DBVR  [SOT95P280X145-5N]

### Blocks framed on the sheet
SPI MISO LEVEL SHIFTER: C61 IC4

### Ports
MISO (out), MISO_5V (in)

### Nets
+MCU: C61.1 IC4.5(VCC)
GND: C61.2 IC4.1(~{OE}) IC4.3(GND)
SPI5_MISO: IC4.4(Y) ; port MISO
UI_MISO: IC4.2(A) ; port MISO_5V

### Notes on the sheet
- 0 Ohms
- (near IC4) from UI

### Library data of the parts
C61 = C0603C104K5RAC7411: as C62 on sheet MCU_AUDIO; Part Number: C0603C104K5RAC7411; Value: 0.1 µF; Applications: Bypass, Decoupling; Capacitance: 0.1 µF; componentlink1description: Datasheet; componentlink1url: https://api.kemet.com/component-edge/download/datasheet/C0603C104K5RAC7411.pdf; componentlink2description: DigiKey Link; componentlink2url: https://www.digikey.com/en/products/detail/kemet/C0603C104K5RAC7411/3317013; Device Package: 0603 (1608 Metric); lastupdated: 2/9/2024 8:10:30 PM; Lifecycle Status: Active; Minimum Order: 1; Mounting Type: Surface Mount, MLCC; Operating Temperature: -55°C ~ 125°C; Package / Case: 0603 (1608 Metric); packaging: TapeAndReel; partid: 2233; Part Status: Active; price: 0.01; series: SMD Comm X7R; Size / Dimension: 0.063" L x 0.031" W (1.60mm x 0.80mm); Supplier 1: DigiKey; Supplier Part Number 1: 399-C0603C104K5RAC7411CT-ND; Temperature Coefficient: X7R; Thickness (Max): 0.035" (0.90mm); Voltage - Rated: 50V
IC4 = SN74LVC1G125DBVR: Integrated Circuit; Manufacturer_Name: Texas Instruments; Datasheet Link: http://www.ti.com/lit/ds/symlink/sn74lvc1g125.pdf; Height: 1.45mm; Manufacturer_Part_Number: SN74LVC1G125DBVR; Mouser Part Number: 595-SN74LVC1G125DBVR; Mouser Price/Stock: https://www.mouser.co.uk/ProductDetail/Texas-Instruments/SN74LVC1G125DBVR?qs=dT9u2OTAaVWCjkJK89JQQg%3D%3D; Arrow Part Number: SN74LVC1G125DBVR; Arrow Price/Stock: https://www.arrow.com/en/products/sn74lvc1g125dbvr/texas-instruments?region=nac

## Sheet LCD_big.SchDoc
size A4; SheetNumber: 2; SheetTotal: 13
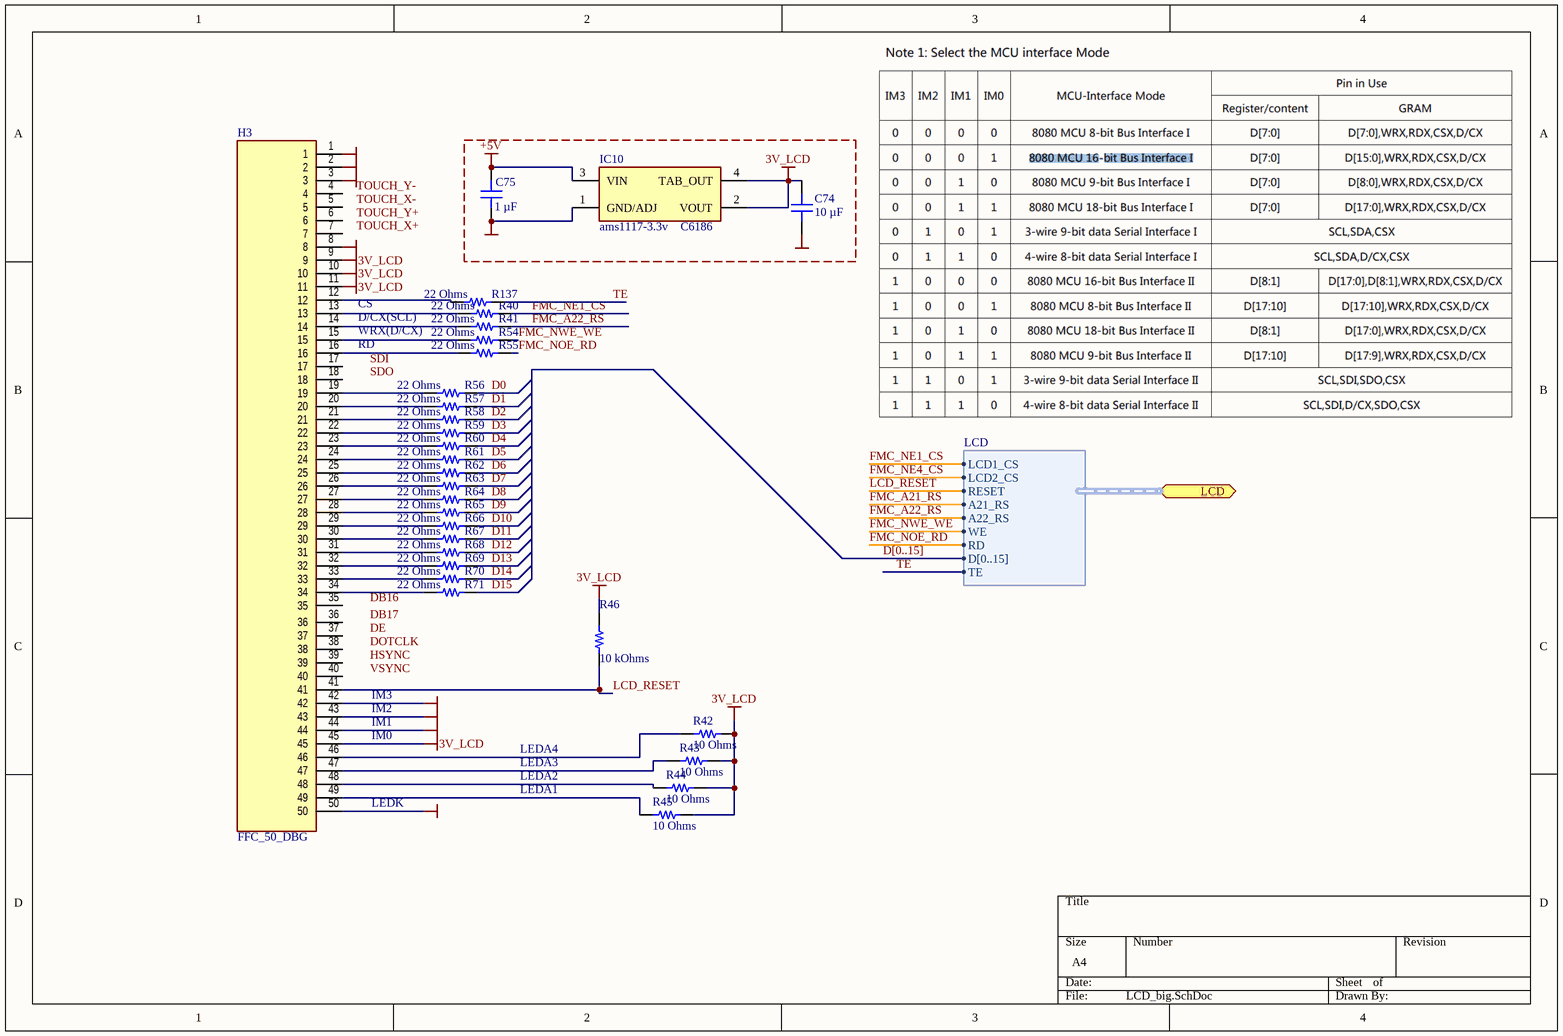
[diagram p14: LCD_big.SchDoc]

### Parts
(Parts that share a designator on the sheet are numbered #1, #2 ... from top to bottom, then left to right.)
C74#1  10 µF  [CAP 0805_2012]
C75  1 µF  [CAP 0805_2012]
H3  FFC_50_DBG  [FFC_50_DBG]
IC10  ams1117-3.3v  Supplier Part Number 1: C6186  [SOT-223]
R40  22 Ohms  [RES 0402_1005]
R41  22 Ohms  [RES 0402_1005]
R42  10 Ohms  [RES 0603_1608]
R43  10 Ohms  [RES 0603_1608]
R44  10 Ohms  [RES 0603_1608]
R45  10 Ohms  [RES 0603_1608]
R46  10 kOhms  [RES 0603_1608]
R54  22 Ohms  [RES 0402_1005]
R55  22 Ohms  [RES 0402_1005]
R56  22 Ohms  [RES 0402_1005]
R57  22 Ohms  [RES 0402_1005]
R58  22 Ohms  [RES 0402_1005]
R59  22 Ohms  [RES 0402_1005]
R60  22 Ohms  [RES 0402_1005]
R61  22 Ohms  [RES 0402_1005]
R62  22 Ohms  [RES 0402_1005]
R63  22 Ohms  [RES 0402_1005]
R64  22 Ohms  [RES 0402_1005]
R65  22 Ohms  [RES 0402_1005]
R66  22 Ohms  [RES 0402_1005]
R67  22 Ohms  [RES 0402_1005]
R68  22 Ohms  [RES 0402_1005]
R69  22 Ohms  [RES 0402_1005]
R70  22 Ohms  [RES 0402_1005]
R71  22 Ohms  [RES 0402_1005]
R137  22 Ohms  [RES 0402_1005]

### Ports
LCD (bidir, harness LCD)

### Harnesses
LCD: LCD1_CS, LCD2_CS, RESET, A21_RS, A22_RS, WE, RD, D[0..15], TE

### Nets
3V_LCD: C74#1.2 H3.9 H3.10 H3.11 H3.45 IC10.2(VOUT) IC10.4(TAB_OUT) R42.2 R43.2 R44.2 R45.2 R46.2
+5V: C75.2 IC10.3(VIN)
GND: C74#1.1 C75.1 H3.1 H3.2 H3.3 H3.8 H3.42 H3.43 H3.44 H3.50 IC10.1(GND/ADJ)
D0: R56.2
D1: R57.2
D2: R58.2
D3: R59.2
D4: R60.2
D5: R61.2
D6: R62.2
D7: R63.2
D8: R64.2
D9: R65.2
D10: R66.2
D11: R67.2
D12: R68.2
D13: R69.2
D14: R70.2
D15: R71.2
FMC_A22_RS: R41.2 ; port LCD.A22_RS
FMC_NE1_CS: R40.2 ; port LCD.LCD1_CS
FMC_NOE_RD: R55.2 ; port LCD.RD
FMC_NWE_WE: R54.2 ; port LCD.WE
LCD_RESET: H3.41 R46.1 ; port LCD.RESET
TE: R137.2 ; port LCD.TE  [project net LCD_TE]
NetH3_12: H3.12 R137.1
NetH3_13: H3.13 R40.1
NetH3_14: H3.14 R41.1
NetH3_15: H3.15 R54.1
NetH3_16: H3.16 R55.1
NetH3_19: H3.19 R56.1
NetH3_20: H3.20 R57.1
NetH3_21: H3.21 R58.1
NetH3_22: H3.22 R59.1
NetH3_23: H3.23 R60.1
NetH3_24: H3.24 R61.1
NetH3_25: H3.25 R62.1
NetH3_26: H3.26 R63.1
NetH3_27: H3.27 R64.1
NetH3_28: H3.28 R65.1
NetH3_29: H3.29 R66.1
NetH3_30: H3.30 R67.1
NetH3_31: H3.31 R68.1
NetH3_32: H3.32 R69.1
NetH3_33: H3.33 R70.1
NetH3_34: H3.34 R71.1
NetH3_46: H3.46 R42.1
NetH3_47: H3.47 R43.1
NetH3_48: H3.48 R44.1
NetH3_49: H3.49 R45.1

Not connected (* = marked no-connect by the designer): H3 4 5 6 7 17 18 35 36 37 38 39 40

### Buses and harness runs
bus D[0..15]

### Notes on the sheet
- (near H3) CS
- D/CX(SCL)
- WRX(D/CX)
- (near H3) RD
- IM2
- IM3
- IM0
- IM1
- LEDA2
- LEDA3
- LEDA4
- LEDK
- LEDA1
- Labels drawn without touching a wire or pin: DB16, DB17, DE, DOTCLK, HSYNC, SDI, SDO, TOUCH_X+, TOUCH_X-, TOUCH_Y+, TOUCH_Y-, VSYNC

### Library data of the parts
C74#1 = C0805C106K8PAC7800: as C71 on sheet MCU_AUDIO; Part Number: C0805C106K8PAC7800; Value: 10 µF; Applications: Bypass, Decoupling; Capacitance: 10 µF; componentlink1description: Datasheet; componentlink1url: https://connect.kemet.com:7667/gateway/IntelliData-ComponentDocumentation/1.0/download/datasheet/C0805C106K8PACTU; componentlink2description: DigiKey Link; componentlink2url: https://www.digikey.com/en/products/detail/kemet/C0805C106K8PAC7800/1090830; Device Package: 0805 (2012 Metric); lastupdated: 9/14/2022 7:51:56 AM; Lifecycle Status: Active; Minimum Order: 1; Mounting Type: Surface Mount, MLCC; Operating Temperature: -55°C ~ 85°C; Package / Case: 0805 (2012 Metric); packaging: TapeAndReel; partid: 44790; Part Status: Active; price: 0.02; series: SMD Comm X5R; Size / Dimension: 0.079" L x 0.049" W (2.00mm x 1.25mm); Supplier 1: DigiKey; Supplier Part Number 1: 399-C0805C106K8PAC7800CT-ND; Temperature Coefficient: X5R; Thickness (Max): 0.055" (1.40mm); Voltage - Rated: 10V
C75 = C0805C105K4RAC7800: as C72 on sheet MCU_AUDIO; Part Number: C0805C105K4RAC7800; Value: 1 µF; Applications: Bypass, Decoupling; Capacitance: 1 µF; componentlink1description: Datasheet; componentlink1url: https://api.kemet.com/component-edge/download/datasheet/C0805C105K4RACTU.pdf; componentlink2description: DigiKey Link; componentlink2url: https://www.digikey.com/en/products/detail/kemet/C0805C105K4RAC7800/416047; Device Package: 0805 (2012 Metric); lastupdated: 9/19/2022 1:03:30 PM; Lifecycle Status: Active; Minimum Order: 1; Mounting Type: Surface Mount, MLCC; Operating Temperature: -55°C ~ 125°C; Package / Case: 0805 (2012 Metric); packaging: TapeAndReel; partid: 32075; Part Status: Active; price: 0.01; series: SMD Comm X7R; Size / Dimension: 0.079" L x 0.049" W (2.00mm x 1.25mm); Supplier 1: DigiKey; Supplier Part Number 1: 399-C0805C105K4RAC7800CT-ND; Temperature Coefficient: X7R; Thickness (Max): 0.039" (1.00mm); Voltage - Rated: 16V
H3 = FFC_50_DBG: System: Connector
IC10 = ams1117-3.3v: Integrated Circuit; Manufacturer_Name: Advanced Monolithic Systems; Datasheet Link: http://www.advanced-monolithic.com/pdf/ds1117.pdf; Height: 1.8mm; Manufacturer_Part_Number: ams1117-3.3v; Supplier 1: LCSC
R40 R41 R54-R71 R137 = RMCF0402JT22R0: RES 22 OHM 5% 1/16W 0402; Manufacturer: Stackpole Electronics Inc; Power (Watts): 0.063W, 1/16W; Temperature Coefficient: ±100ppm/°C; Part Number: RMCF0402JT22R0; Value: 22 Ohms; ComponentLink1Description: Datasheet; ComponentLink1URL: https://www.seielect.com/catalog/sei-rmcf_rmcp.pdf; ComponentLink2Description: DigiKey Link; ComponentLink2URL: https://www.digikey.com/en/products/detail/stackpole-electronics-inc/RMCF0402JT22R0/1758165; Composition: Thick Film; Device Package: 0402 (1005 Metric); Features: Automotive AEC-Q200; Height - Seated (Max): 0.016" (0.40mm); LastUpdated: 2/9/2024 8:30:03 PM; Lifecycle Status: Active; Minimum Order: 1; Number of Terminations: 2; Operating Temperature: -55°C ~ 155°C; Package / Case: 0402 (1005 Metric); Packaging: CutTape; PartId: 7671; Part Status: Active; Price: 0.01; Resistance: 22 Ohms; Series: RMCF; Size / Dimension: 0.039" L x 0.020" W (1.00mm x 0.50mm); Supplier 1: DigiKey; Supplier Part Number 1: RMCF0402JT22R0CT-ND; Supplier Device Package: 0402; Tolerance: ±5%; Ratings: AEC-Q200
R42-R45 = ERJ-PA3F10R0V: RES SMD 10 OHM 1% 1/3W 0603; Manufacturer: Panasonic Electronic Components; Power (Watts): 0.333W, 1/3W; Temperature Coefficient: ±100ppm/°C; Part Number: ERJ-PA3F10R0V; Value: 10 Ohms; ComponentLink1Description: Datasheet; ComponentLink1URL: https://industrial.panasonic.com/cdbs/www-data/pdf/RDO0000/AOA0000C331.pdf; ComponentLink2Description: DigiKey Link; ComponentLink2URL: https://www.digikey.com/en/products/detail/panasonic-electronic-components/ERJ-PA3F10R0V/5035852; Composition: Thick Film; Device Package: 0603 (1608 Metric); Features: Automotive AEC-Q200, Pulse Withstanding; Height - Seated (Max): 0.022" (0.55mm); Lifecycle Status: Active; Minimum Order: 1; Number of Terminations: 2; Operating Temperature: -55°C ~ 155°C; Package / Case: 0603 (1608 Metric); Packaging: TapeAndReel; PartId: 5368; Part Status: Active; Price: 0.01; Ratings: AEC-Q200; Resistance: 10 Ohms; Series: ERJ-PA3; Size / Dimension: 0.063" L x 0.031" W (1.60mm x 0.80mm); Supplier 1: DigiKey; Supplier Part Number 1: P10.00BYCT-ND; Supplier Device Package: 0603; Tolerance: ±1%
  R42: LastUpdated: 2/9/2024 8:43:35 PM
  R43-R45: LastUpdated: 9/16/2023 7:33:50 PM
R46 = ERJ-3EKF1002V: as R6 on sheet MCU_AUDIO; Part Number: ERJ-3EKF1002V; Value: 10 kOhms; ComponentLink1Description: Datasheet; ComponentLink1URL: https://industrial.panasonic.com/cdbs/www-data/pdf/RDA0000/AOA0000C304.pdf; ComponentLink2Description: DigiKey Link; ComponentLink2URL: https://www.digikey.com/en/products/detail/panasonic-electronic-components/ERJ-3EKF1002V/196066; Composition: Thick Film; Device Package: 0603 (1608 Metric); Height - Seated (Max): 0.022" (0.55mm); LastUpdated: 2/9/2024 8:41:59 PM; Lifecycle Status: Active; Minimum Order: 1; Number of Terminations: 2; Operating Temperature: -55°C ~ 155°C; Package / Case: 0603 (1608 Metric); Packaging: TapeAndReel; PartId: 25695; Part Status: Active; Price: 0.01; Resistance: 10 kOhms; Series: ERJ-3EK; Size / Dimension: 0.063" L x 0.031" W (1.60mm x 0.80mm); Supplier 1: DigiKey; Supplier Part Number 1: P10.0KHCT-ND; Supplier Device Package: 0603; Tolerance: ±1%; Features: Automotive AEC-Q200; Ratings: AEC-Q200

## Sheet FOOT_CN.SchDoc
size A4; SheetNumber: 3; SheetTotal: 13
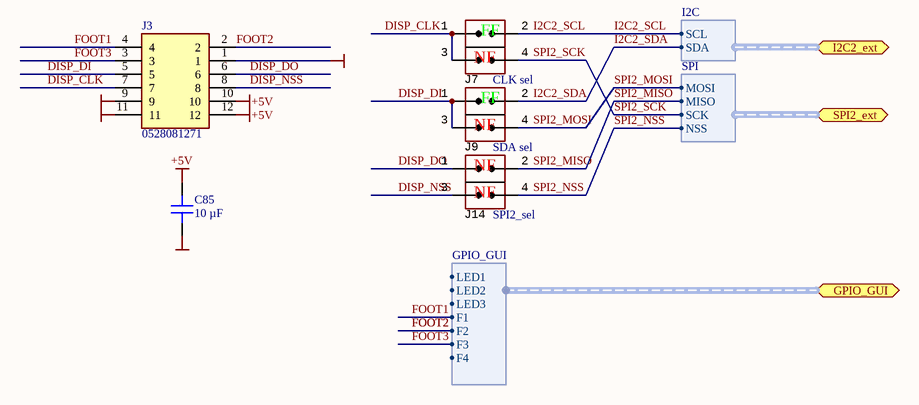
[diagram p15: FOOT_CN.SchDoc]

### Parts
(Parts that share a designator on the sheet are numbered #1, #2 ... from top to bottom, then left to right.)
C85  10 µF  [CAP 0805_2012]
J3#2  0528081271  [AFA11-S12GLA-00]
J7#2  (no value)  [CON: JUMPER x2]
J9#2  (no value)  [CON: JUMPER x2]
J14  (no value)  [CON: JUMPER x2]

### Ports
GPIO_GUI (bidir, harness GPIO_GUI), I2C2_ext (bidir, harness I2C), SPI2_ext (bidir, harness SPI)

### Harnesses
I2C: SCL, SDA
SPI: MOSI, MISO, SCK, NSS
GPIO_GUI: LED1, LED2, F1, F2, F3, F4, LED3

### Nets
+5V: C85.2 J3#2.10 J3#2.12
GND: C85.1 J3#2.1 J3#2.9 J3#2.11
DISP_CLK: J3#2.7 J7#2.1(IN) J7#2.3(IN)  [project net DISP_CLK_3]
DISP_DI: J3#2.5 J9#2.1(IN) J9#2.3(IN)  [project net DISP_DI_3]
DISP_DO: J3#2.6 J14.1(IN)  [project net DISP_DO_3]
DISP_NSS: J3#2.8 J14.3(IN)  [project net DISP_NSS_3]
FOOT1: J3#2.4 ; port GPIO_GUI.F1
FOOT2: J3#2.2 ; port GPIO_GUI.F2
FOOT3: J3#2.3 ; port GPIO_GUI.F3
I2C2_SCL: J7#2.2(IN) ; port I2C2_ext.SCL
I2C2_SDA: J9#2.2(IN) ; port I2C2_ext.SDA
SPI2_MISO: J14.2(IN) ; port SPI2_ext.MISO  [project net SPI2_ext.MISO]
SPI2_MOSI: J9#2.4(IN) ; port SPI2_ext.MOSI  [project net SPI2_ext.MOSI]
SPI2_NSS: J14.4(IN) ; port SPI2_ext.NSS  [project net SPI2_ext.NSS]
SPI2_SCK: J7#2.4(IN) ; port SPI2_ext.SCK  [project net SPI2_ext.SCK]

### Notes on the sheet
- (near J7#2) NF
- (near J7#2) FF
- (near J9#2) FF
- CLK sel
- (near J9#2) NF
- (near J14) NF
- SDA sel
- (near J14) SPI2_sel

### Library data of the parts
C85 = C0805C106K8PAC7800: as C71 on sheet MCU_AUDIO; Part Number: C0805C106K8PAC7800; Value: 10 µF; Applications: Bypass, Decoupling; Capacitance: 10 µF; componentlink1description: Datasheet; componentlink1url: https://connect.kemet.com:7667/gateway/IntelliData-ComponentDocumentation/1.0/download/datasheet/C0805C106K8PACTU; componentlink2description: DigiKey Link; componentlink2url: https://www.digikey.com/en/products/detail/kemet/C0805C106K8PAC7800/1090830; Device Package: 0805 (2012 Metric); lastupdated: 9/14/2022 7:51:56 AM; Lifecycle Status: Active; Minimum Order: 1; Mounting Type: Surface Mount, MLCC; Operating Temperature: -55°C ~ 85°C; Package / Case: 0805 (2012 Metric); packaging: TapeAndReel; partid: 44790; Part Status: Active; price: 0.02; series: SMD Comm X5R; Size / Dimension: 0.079" L x 0.049" W (2.00mm x 1.25mm); Supplier 1: DigiKey; Supplier Part Number 1: 399-C0805C106K8PAC7800CT-ND; Temperature Coefficient: X5R; Thickness (Max): 0.055" (1.40mm); Voltage - Rated: 10V
J3#2 = 0528081271: Connector; Manufacturer_Name: Molex; Datasheet Link: https://www.molex.com/pdm_docs/sd/528082071_sd.pdf; Height: 5.3mm; Manufacturer_Part_Number: 0528081271; System: Connector
J7#2 J9#2 J14 = Jumper_double: CommentText: "Перемычка"

## Sheet Codec_CN.SchDoc
size A3; SheetNumber: 9; SheetTotal: 10
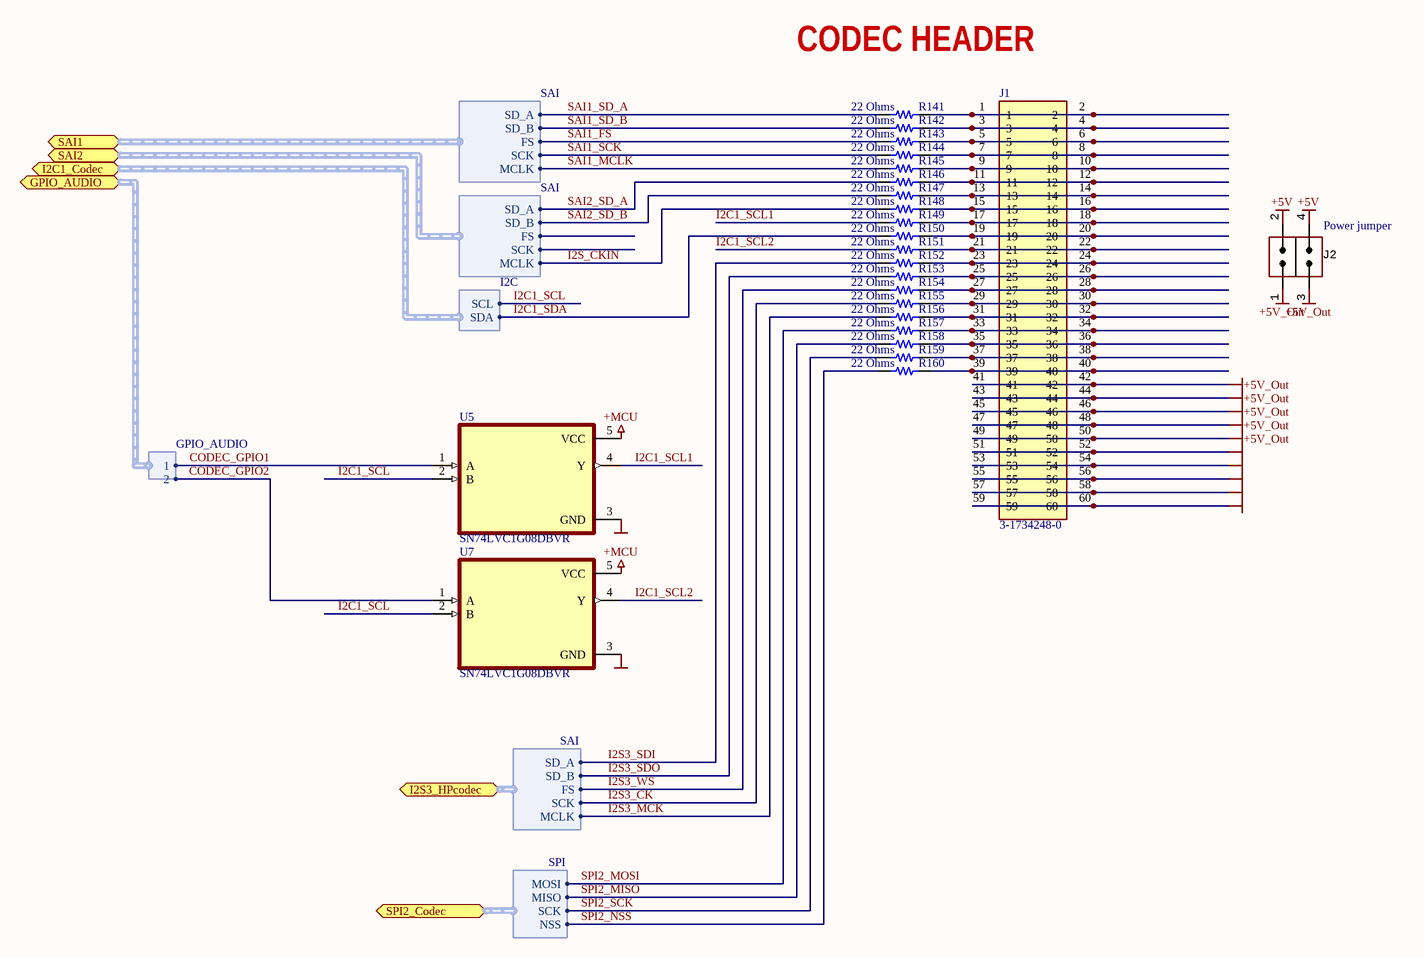
[diagram p16: Codec_CN.SchDoc]

### Parts
(Parts that share a designator on the sheet are numbered #1, #2 ... from top to bottom, then left to right.)
J1#3  3-1734248-0  [317342480]
J2#2  (no value)  [CON: JUMPER x2]
R141  22 Ohms  [RES 0402_1005]
R142  22 Ohms  [RES 0402_1005]
R143  22 Ohms  [RES 0402_1005]
R144  22 Ohms  [RES 0402_1005]
R145  22 Ohms  [RES 0402_1005]
R146  22 Ohms  [RES 0402_1005]
R147  22 Ohms  [RES 0402_1005]
R148  22 Ohms  [RES 0402_1005]
R149  22 Ohms  [RES 0402_1005]
R150  22 Ohms  [RES 0402_1005]
R151  22 Ohms  [RES 0402_1005]
R152  22 Ohms  [RES 0402_1005]
R153  22 Ohms  [RES 0402_1005]
R154  22 Ohms  [RES 0402_1005]
R155  22 Ohms  [RES 0402_1005]
R156  22 Ohms  [RES 0402_1005]
R157  22 Ohms  [RES 0402_1005]
R158  22 Ohms  [RES 0402_1005]
R159  22 Ohms  [RES 0402_1005]
R160  22 Ohms  [RES 0402_1005]
U5  SN74LVC1G08DBVR  [SOT95P280X145-5N]
U7  SN74LVC1G08DBVR  [SOT95P280X145-5N]

### Ports
GPIO_AUDIO (bidir, harness GPIO_AUDIO), I2C1_Codec (bidir, harness I2C), I2S3_HPcodec (bidir, harness SAI), SAI1 (bidir, harness SAI), SAI2 (bidir, harness SAI), SPI2_Codec (bidir, harness SPI)

### Harnesses
SAI: SD_A, SD_B, FS, SCK, MCLK
GPIO_AUDIO: 1, 2
I2C: SCL, SDA
SPI: MOSI, MISO, SCK, NSS

### Nets
+5V: J2#2.2(IN) J2#2.4(IN)
+5V_Out: J1#3.41 J1#3.42 J1#3.43 J1#3.44 J1#3.45 J1#3.46 J1#3.47 J1#3.48 J1#3.49 J1#3.50 J2#2.1(IN) J2#2.3(IN)
+MCU: U5.5(VCC) U7.5(VCC)
GND: J1#3.51 J1#3.52 J1#3.53 J1#3.54 J1#3.55 J1#3.56 J1#3.57 J1#3.58 J1#3.59 J1#3.60 U5.3(GND) U7.3(GND)
CODEC_GPIO1: U5.1(A) ; port GPIO_AUDIO.1
CODEC_GPIO2: U7.1(A) ; port GPIO_AUDIO.2
I2C1_SCL: U5.2(B) U7.2(B) ; port I2C1_Codec.SCL
I2C1_SCL1: R149.1 U5.4(Y)  [project net I2C1_SCL1_9]
I2C1_SCL2: R151.1 U7.4(Y)  [project net I2C1_SCL2_9]
I2C1_SDA: R150.1 ; port I2C1_Codec.SDA
I2S3_CK: R155.1 ; port I2S3_HPcodec.SCK
I2S3_MCK: R156.1 ; port I2S3_HPcodec.MCLK
I2S3_SDI: R152.1 ; port I2S3_HPcodec.SD_A
I2S3_SDO: R153.1 ; port I2S3_HPcodec.SD_B
I2S3_WS: R154.1 ; port I2S3_HPcodec.FS
I2S_CKIN: R148.1 ; port SAI2.MCLK
SAI1_FS: R143.1  [project net SAI1_FS_9]
SAI1_MCLK: R145.1 ; port SAI1.MCLK
SAI1_SCK: R144.1 ; port SAI1.SCK
SAI1_SD_A: R141.1 ; port SAI1.SD_A
SAI1_SD_B: R142.1  [project net SAI1_SD_B_9]
SAI2_SD_A: R146.1 ; port SAI2.SD_A
SAI2_SD_B: R147.1 ; port SAI2.SD_B
SPI2_MISO: R158.1 ; port SPI2_Codec.MISO
SPI2_MOSI: R157.1 ; port SPI2_Codec.MOSI
SPI2_NSS: R160.1 ; port SPI2_Codec.NSS
SPI2_SCK: R159.1 ; port SPI2_Codec.SCK
NetJ1#3_1: J1#3.1 J1#3.2 R141.2
NetJ1#3_3: J1#3.3 J1#3.4 R142.2
NetJ1#3_5: J1#3.5 J1#3.6 R143.2
NetJ1#3_7: J1#3.7 J1#3.8 R144.2
NetJ1#3_9: J1#3.9 J1#3.10 R145.2
NetJ1#3_11: J1#3.11 J1#3.12 R146.2
NetJ1#3_13: J1#3.13 J1#3.14 R147.2
NetJ1#3_15: J1#3.15 J1#3.16 R148.2
NetJ1#3_17: J1#3.17 J1#3.18 R149.2
NetJ1#3_19: J1#3.19 J1#3.20 R150.2
NetJ1#3_21: J1#3.21 J1#3.22 R151.2
NetJ1#3_23: J1#3.23 J1#3.24 R152.2
NetJ1#3_25: J1#3.25 J1#3.26 R153.2
NetJ1#3_27: J1#3.27 J1#3.28 R154.2
NetJ1#3_29: J1#3.29 J1#3.30 R155.2
NetJ1#3_31: J1#3.31 J1#3.32 R156.2
NetJ1#3_33: J1#3.33 J1#3.34 R157.2
NetJ1#3_35: J1#3.35 J1#3.36 R158.2
NetJ1#3_37: J1#3.37 J1#3.38 R159.2
NetJ1#3_39: J1#3.39 J1#3.40 R160.2

### Notes on the sheet
- CODEC HEADER
- (near J2#2) Power jumper

### Library data of the parts
J1#3 = 3-1734248-0: Connector; Manufacturer_Name: TE Connectivity; Datasheet Link: https://www.te.com/commerce/DocumentDelivery/DDEController?Action=srchrtrv&DocNm=5-1773461-0_Standard_FPC_Connectors_QRG&DocType=Data%20Sheet&DocLang=English&PartCntxt=3-1734248-0&DocFormat=pdf; Height: 7.7mm; Manufacturer_Part_Number: 3-1734248-0; Mouser Part Number: 571-3-1734248-0; Mouser Price/Stock: https://www.mouser.co.uk/ProductDetail/TE-Connectivity/3-1734248-0?qs=rVE9j%252BL6g1a4TQRjUuGYiA%3D%3D; Arrow Part Number: 3-1734248-0; Arrow Price/Stock: https://www.arrow.com/en/products/3-1734248-0/te-connectivity; System: Connector
J2#2 = Jumper_double: CommentText: "Перемычка"
R141-R160 = RMCF0402JT22R0: RES 22 OHM 5% 1/16W 0402; Manufacturer: Stackpole Electronics Inc; Power (Watts): 0.063W, 1/16W; Temperature Coefficient: ±100ppm/°C; Part Number: RMCF0402JT22R0; Value: 22 Ohms; ComponentLink1Description: Datasheet; ComponentLink1URL: https://www.seielect.com/catalog/sei-rmcf_rmcp.pdf; ComponentLink2Description: DigiKey Link; ComponentLink2URL: https://www.digikey.com/en/products/detail/stackpole-electronics-inc/RMCF0402JT22R0/1758165; Composition: Thick Film; Device Package: 0402 (1005 Metric); Features: Automotive AEC-Q200; Height - Seated (Max): 0.016" (0.40mm); LastUpdated: 2/9/2024 8:30:03 PM; Lifecycle Status: Active; Minimum Order: 1; Number of Terminations: 2; Operating Temperature: -55°C ~ 155°C; Package / Case: 0402 (1005 Metric); Packaging: CutTape; PartId: 7671; Part Status: Active; Price: 0.01; Resistance: 22 Ohms; Series: RMCF; Size / Dimension: 0.039" L x 0.020" W (1.00mm x 0.50mm); Supplier 1: DigiKey; Supplier Part Number 1: RMCF0402JT22R0CT-ND; Supplier Device Package: 0402; Tolerance: ±5%; Ratings: AEC-Q200
U5 U7 = SN74LVC1G08DBVR: 1-ch, 2-input 1.65-V to 5.5-V 32 mA drive strength AND gate; MF: Texas Instruments; SnapEDA_Link: https://www.snapeda.com/parts/SN74LVC1G08DBVR/Texas+Instruments/view-part/?ref=snap; Package: SOT-23-5 Texas Instruments; Value: *; MP: SN74LVC1G08DBVR; Check_prices: https://www.snapeda.com/parts/SN74LVC1G08DBVR/Texas+Instruments/view-part/?ref=eda